# Altium schematic sheet Mach_Probe.SchDoc: Mach Probe Data Logger
size A4; Date: 16.03.2025; Author: Bexultan Tokkozha; CompanyName: WARR; DrawnBy: Bexultan Tokkozha; Engineer: Bexultan Tokkozha; Organization: WARR e.V.; Address1: Boltzmannstr. 15; Address2: 85748 Garching; Address3: Germany; DocumentNumber: 1; Revision: Rev.3; SheetNumber: 1; SheetTotal: 2; ReviewDate: 05.04.2025
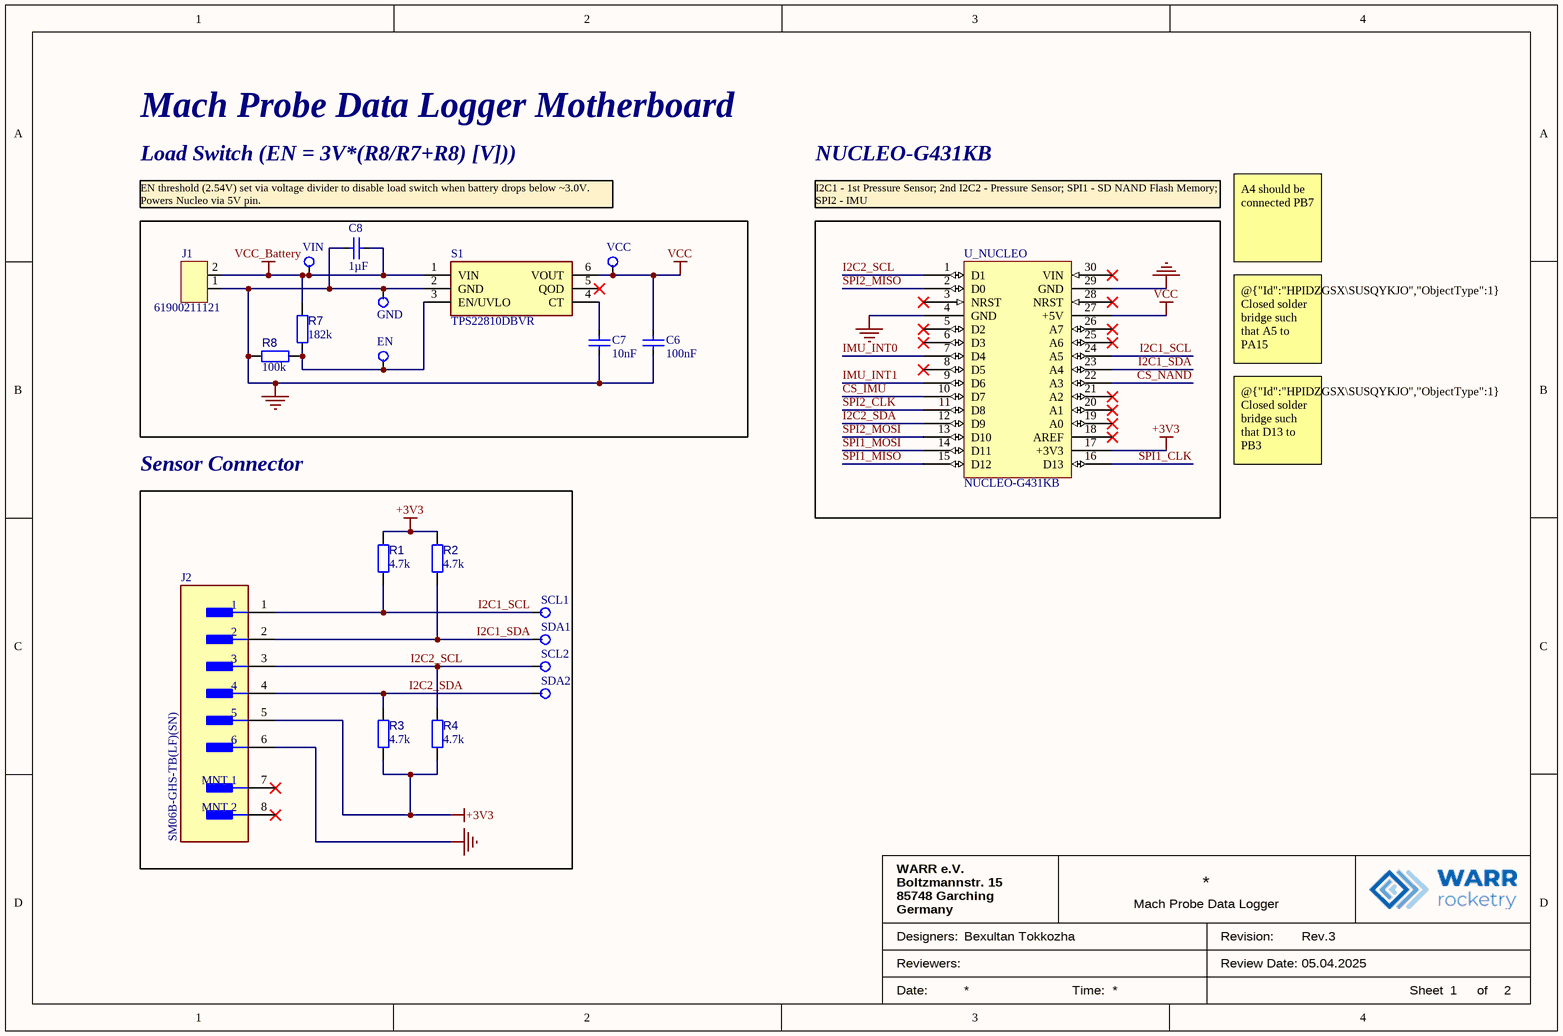
[diagram p0: Mach_Probe.SchDoc]

## Parts
C6  value 100nF  [CAP_0603]  (hidden comment: C_0603_100n_5%_50V)
C7  value 10nF  [CAP_0603]  (hidden comment: C_0603_10n_5%_50V)
C8  value 1µF  [CAP_0603]  (hidden comment: C_0603_1u_10%_50V)
EN  Testpoint  [Testpoint-Footprint-1]  (value not drawn)  (no BOM)
GND  Testpoint  [Testpoint-Footprint-1]  (value not drawn)  (no BOM)
J1  61900211121  [61900211121]
J2  SM06B-GHS-TB(LF)(SN)  [FP-SM06B-GHS-TB_LF_SN-MFG]
R1  value 4.7k  [RES_0603_YAGEO]  (hidden comment: RES_0603_4k7_1%_0.1W)
R2  value 4.7k  [RES_0603_YAGEO]  (hidden comment: RES_0603_4k7_1%_0.1W)
R3  value 4.7k  [RES_0603_YAGEO]  (hidden comment: RES_0603_4k7_1%_0.1W)
R4  value 4.7k  [RES_0603_YAGEO]  (hidden comment: RES_0603_4k7_1%_0.1W)
R7  value 182k  [RES_0603_YAGEO]  (hidden comment: RES_0603_182k_1%_0.1W)
R8  value 100k  [RES_0603_YAGEO]  (hidden comment: RES_0603_100k_1%_0.1W)
S1  TPS22810DBVR  [SOT95P280X145-6N]
SCL1  Testpoint  [Testpoint-Footprint-1]  (value not drawn)  (no BOM)
SCL2  Testpoint  [Testpoint-Footprint-1]  (value not drawn)  (no BOM)
SDA1  Testpoint  [Testpoint-Footprint-1]  (value not drawn)  (no BOM)
SDA2  Testpoint  [Testpoint-Footprint-1]  (value not drawn)  (no BOM)
U_NUCLEO  NUCLEO-G431KB  [NUCLEO-G431KB-Footprint-1]
VCC  Testpoint  [Testpoint-Footprint-1]  (value not drawn)  (no BOM)
VIN  Testpoint  [Testpoint-Footprint-1]  (value not drawn)  (no BOM)

## Blocks framed on the sheet
Sensor Connector: J2 R1-R4 SCL1 SCL2 SDA1 SDA2

## Nets
+3V3: J2.5 R1.2 R2.2 R3.2 R4.2 U_NUCLEO.17(+3V3)
GND: C6.2 C7.2 C8.1 GND.1 J1.1(=Designator) J2.6 R8.2 S1.2(GND) U_NUCLEO.4(GND) U_NUCLEO.29(GND)
VCC: C6.1 S1.6(VOUT) U_NUCLEO.27(+5V) VCC.1
VCC_Battery: C8.2 J1.2(=Designator) R7.2 S1.1(VIN) VIN.1
CS_IMU: U_NUCLEO.10(D7)
CS_NAND: U_NUCLEO.22(A3)
I2C1_SCL: J2.1 R1.1 SCL1.1 U_NUCLEO.24(A5)
I2C1_SDA: J2.2 R2.1 SDA1.1 U_NUCLEO.23(A4)
I2C2_SCL: J2.3 R4.1 SCL2.1 U_NUCLEO.1(D1)
I2C2_SDA: J2.4 R3.1 SDA2.1 U_NUCLEO.12(D9)
IMU_INT0: U_NUCLEO.7(D4)
IMU_INT1: U_NUCLEO.9(D6)
SPI1_CLK: U_NUCLEO.16(D13)
SPI1_MISO: U_NUCLEO.15(D12)
SPI1_MOSI: U_NUCLEO.14(D11)
SPI2_CLK: U_NUCLEO.11(D8)
SPI2_MISO: U_NUCLEO.2(D0)
SPI2_MOSI: U_NUCLEO.13(D10)
NetC7_1: C7.1 S1.4(CT)
NetEN_1: EN.1 R7.1 R8.1 S1.3(EN/UVLO)

Not connected (* = marked no-connect by the designer): J2 7(MNT_1)* 8(MNT_2)*; S1 5(QOD)*; U_NUCLEO 3(NRST)* 5(D2)* 6(D3)* 8(D5)* 18(AREF)* 19(A0)* 20(A1)* 21(A2)* 25(A6)* 26(A7)* 28(NRST)* 30(VIN)*

## Notes on the sheet
- Mach Probe Data Logger Motherboard
- Load Switch (EN = 3V*(R8/R7+R8) [V]))
- NUCLEO-G431KB
- EN threshold (2.54V) set via voltage divider to disable load switch when battery drops below ~3.0V. Powers Nucleo via 5V pin.
- I2C1 - 1st Pressure Sensor; 2nd I2C2 - Pressure Sensor; SPI1 - SD NAND Flash Memory; SPI2 - IMU
- A4 should be connected PB7
- @{"Id":"HPIDZGSX\SUSQYKJO","ObjectType":1} Closed solder bridge such that A5 to PA15
- @{"Id":"HPIDZGSX\SUSQYKJO","ObjectType":1} Closed solder bridge such that D13 to PB3
- Designers:
- Reviewers:
- Date:
- Time:
- Revision:
- Review Date:
- Sheet
- of

## Library data of the parts
C6 = CMP-001-00115-4: Ceramic Capacitor, Multilayer, Ceramic, 50V, 5% +Tol, 5% -Tol, X7R, 15% TC, 0.1uF, Surface Mount, 0603; Voltage Rating: 50V; Capacitor Type: Ceramic; Max Operating Temperature: 125°C; Pins: 2; Case/Package: 0603; Min Operating Temperature: -55°C; Mounting Technology: Surface Mount; RoHS Compliant: Yes
C7 = CMP-001-00107-9: Ceramic Capacitor, Multilayer, Ceramic, 50V, 5% +Tol, 5% -Tol, X7R, 15% TC, 0.01uF, Surface Mount, 0603; Capacitor Type: Ceramic; Mounting Technology: Surface Mount; Tolerance: 5%; Case/Package: 0603; Pins: 2; Voltage Rating: 50V; RoHS Compliant: Yes; Min Operating Temperature: -55°C; Max Operating Temperature: 125°C
C8 = CMP-001-00112-5: Ceramic Capacitor, Multilayer, Ceramic, 50V, 10% +Tol, 10% -Tol, 1uF, Surface Mount, 0603; Min Operating Temperature: -55°C; Pins: 2; Mounting Technology: Surface Mount; Voltage Rating: 50V; RoHS Compliant: Yes; Case/Package: 0603; Max Operating Temperature: 85°C; Capacitor Type: Ceramic
EN GND SCL1 SCL2 SDA1 SDA2 VCC VIN = CMP-00030-00002-7: Schematic for Testpoint
J1 = CMP-00047-5: Molex KK 2 Pin; Manufacturer Series: 6190; Contact Style: SQ PIN-SKT; Body/Shell Style: RECEPTACLE; Connector Type: BOARD CONNECTOR; Rated Current (Signal): 3A; Mating Contact Pitch: 0.1inch; Body Breadth: 0.228inch; Mounting Option 1: LOCKING; Body Length: 0.201inch; Reliability: COMMERCIAL; Contact Resistance: 20mR; Dielectric Withstanding Voltage (AC): 1kV; Body Depth: 0.453inch; Polarization Key: POLARIZED HOUSING; Contact Pattern: RECTANGULAR; Additional Feature: ROHS COMPLIANT; Reference Standard: UL; Durability: 25Cycles; Insulation Resistance: 1GR; Number Of PCB Rows: 1; Number of Contacts: 2; Contact Gender: Male; Terminal Pitch: 2.54mm; Insulation Color: Beige; Insulation Material: Nylon; JESD-609 Code: e3; Mounting Style: STRAIGHT; Max Operating Temperature: 105°C; RoHS Compliant: Yes; Reach SVHC Compliant: Yes; Contact Finish - Termination: Tin (Sn) - with Nickel (Ni) barrier; Termination: Solder; Number Of Connectors: 1; PCB Contact Pattern: RECTANGULAR; Mounting Technology: Board; Terminal Length: 0.134inch; Contact Material: Copper Alloy; Min Operating Temperature: -40°C; Number of Rows Loaded: 1; Contact Finish - Mating: SN
J2 = CMP-17439-000061-1: CONN HEADER SMD R/A 6POS 1.25MM; Number of Contacts: 6; Voltage Rating: 50V; Current Rating: 1A; Connector Type: Outer Shroud Contact; Contact Resistance: 50mR; Orientation: Right Angle; Max Operating Temperature: 85°C; Mount: Surface Mount; Packaging: Tape and Reel; Contact Plating: Tin; Depth: 4.05mm; Max Voltage Rating (AC): 50V; Lead Free: Lead Free; Pitch: 1.25mm; Number of Positions: 6; Max Current Rating: 1A; Termination: Solder; Min Operating Temperature: -25°C; Housing Color: Beige; Fastening Type: Ramp; Length: 10.75mm; Color: Natural; Contact Material: Bronze; Housing Material: Polyamide; Number of Rows: 1
R1-R4 = CMP-009-00218-2: Fixed Resistor, Metal Glaze/thick Film, 0.1W, 4700ohm, 75V, 1% +/-Tol, 100ppm/Cel, Surface Mount, 0603; Power: 100mW; Tolerance: 1%; Min Operating Temperature: -55°C; Case/Package: 0603; RoHS Compliant: Yes; Max Operating Temperature: 155°C; Mounting Technology: Surface Mount
R7 = CMP-009-00229-2: Fixed Resistor, Metal Glaze/thick Film, 0.1W, 182000ohm, 75V, 1% +/-Tol, 100ppm/Cel, Surface Mount, 0603; Power: 100mW; Mounting Technology: Surface Mount; Tolerance: 1%; Max Operating Temperature: 155°C; RoHS Compliant: Yes; Min Operating Temperature: -55°C; Case/Package: 0603
R8 = CMP-009-00200-5: Fixed Resistor, Metal Glaze/thick Film, 0.1W, 100000ohm, 75V, 1% +/-Tol, 100ppm/Cel, Surface Mount, 0603; Power: 100mW; Mounting Technology: Surface Mount; RoHS Compliant: Yes; Tolerance: 1%; Min Operating Temperature: -55°C; Max Operating Temperature: 155°C; Case/Package: 0603
S1 = TPS22810DBVR: Switch; Manufacturer_Name: Texas Instruments; Datasheet Link: http://www.ti.com/lit/gpn/tps22810; Height: 1.45mm; Manufacturer_Part_Number: TPS22810DBVR; Mouser Part Number: 595-TPS22810DBVR; Mouser Price/Stock: https://www.mouser.co.uk/ProductDetail/Texas-Instruments/TPS22810DBVR?qs=34RfhUjJmKcFqeJVMZZhPA%3D%3D; Arrow Part Number: TPS22810DBVR; Arrow Price/Stock: https://www.arrow.com/en/products/tps22810dbvr/texas-instruments?utm_currency=USD&region=nac
U_NUCLEO = CMP-00030-00006-8: STM32G431 Nucleo-32 Bit ARM Cortex-M4 Microcontroller Evaluation Board